# Altium schematic sheet VoltageSens.SchDoc
size A4
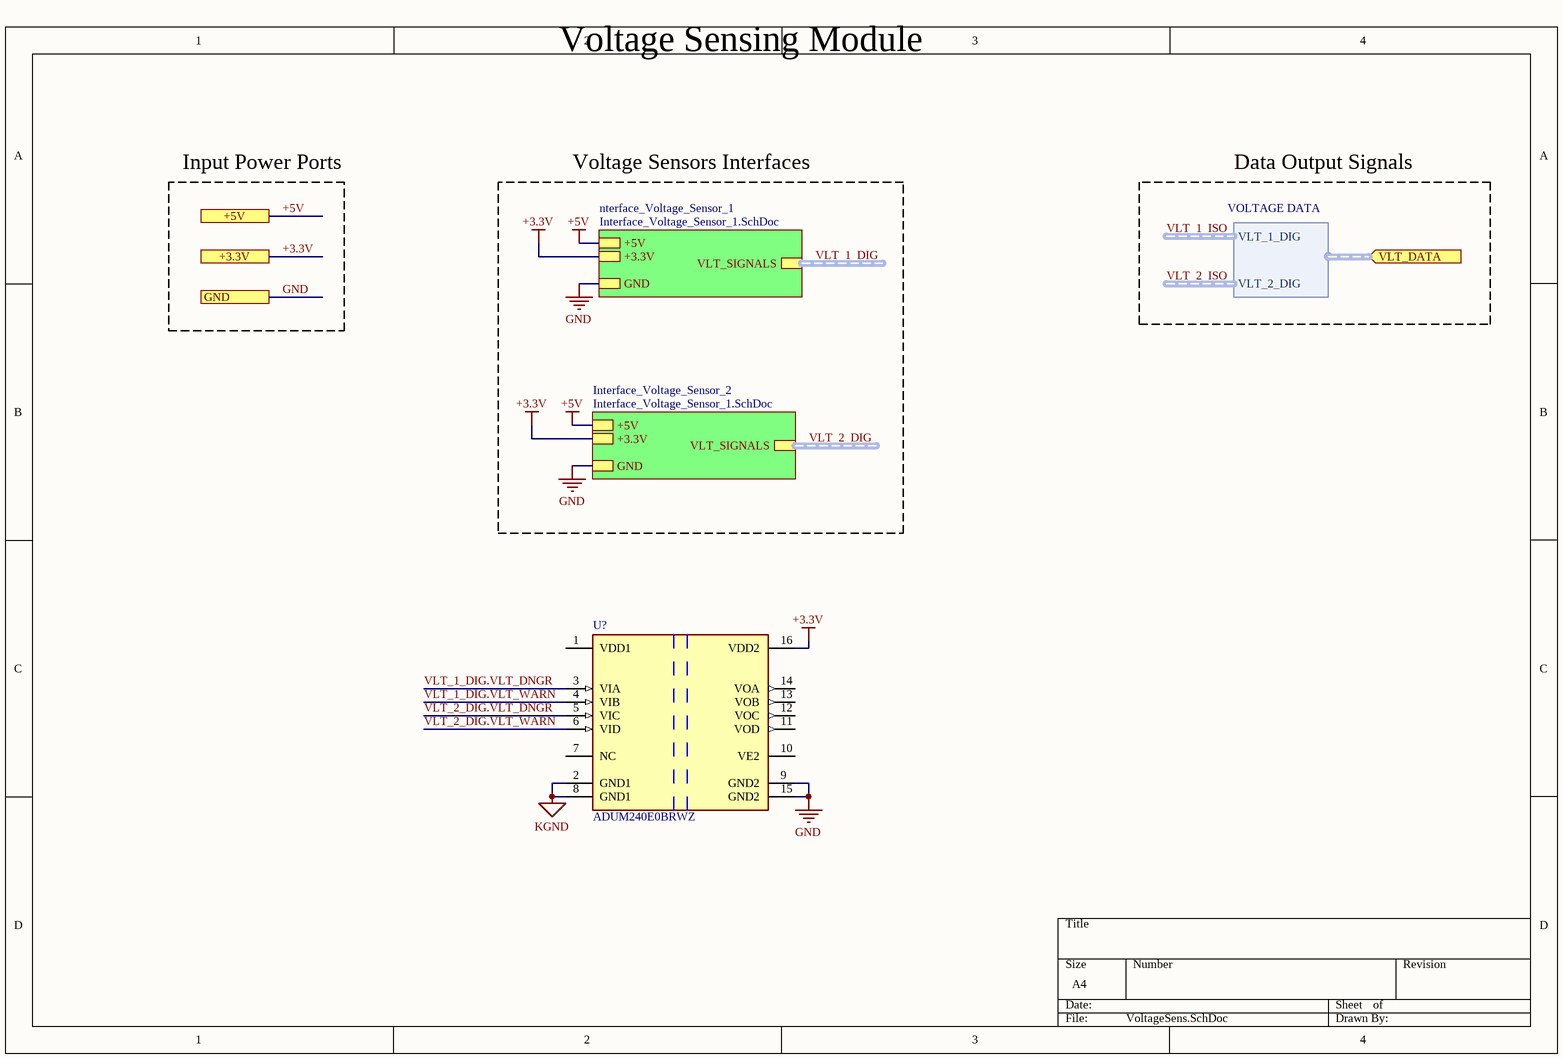
[diagram p0: VoltageSens.SchDoc]

## Parts
U?  ADUM240E0BRWZ  [FP-RW-16-IPC_A]

## Sub-sheets
Interface_Voltage_Sensor_2 = Interface_Voltage_Sensor_1.SchDoc: GND, +5V, +3.3V, VLT_SIGNALS (harness VOLTAGE SIGNALS)
nterface_Voltage_Sensor_1 = Interface_Voltage_Sensor_1.SchDoc: GND, +5V, +3.3V, VLT_SIGNALS (harness VOLTAGE SIGNALS)

## Ports
+3.3V, +5V, GND, VLT_DATA (in, harness VOLTAGE DATA)

## Harnesses
VOLTAGE DATA: VLT_1_DIG, VLT_2_DIG

## Nets
+3.3V: U?.16(VDD2) ; port +3.3V, sheet Interface_Voltage_Sensor_2/+3.3V, sheet nterface_Voltage_Sensor_1/+3.3V
+5V: port +5V, sheet Interface_Voltage_Sensor_2/+5V, sheet nterface_Voltage_Sensor_1/+5V
GND: U?.9(GND2) U?.15(GND2) ; port GND, sheet Interface_Voltage_Sensor_2/GND, sheet nterface_Voltage_Sensor_1/GND
KGND: U?.2(GND1) U?.8(GND1)
VLT_1_DIG.VLT_DNGR: U?.3(VIA)
VLT_1_DIG.VLT_WARN: U?.4(VIB)
VLT_2_DIG.VLT_DNGR: U?.5(VIC)
VLT_2_DIG.VLT_WARN: U?.6(VID)

Not connected (* = marked no-connect by the designer): U? 1(VDD1) 7(NC) 10(VE2) 11(VOD) 12(VOC) 13(VOB) 14(VOA)

## Buses and harness runs
harness VLT_1_DIG = sheet nterface_Voltage_Sensor_1/VLT_SIGNALS
harness VLT_2_DIG = sheet Interface_Voltage_Sensor_2/VLT_SIGNALS

## Notes on the sheet
- Voltage Sensing Module
- Input Power Ports
- Voltage Sensors Interfaces
- Data Output Signals

## Library data of the parts
U? = CMP-015-00008-1: Analog Circuit, 1 Func, CMOS, PDSO16; Min Supply Voltage: 1.7V; Time @ Peak Reflow Temperature-Max (s): 30s; Max Supply Voltage: 5.5V; Channels: 1; Package Body Material: Plastic; Nominal Supply Voltage: 1.8V; Height - Seated (Max): 2.65mm; JESD-30 Code: R-PDSO-G16; Peak Reflow Temperature (Cel): 260°C; Package Shape: Rectangular; Throw Configuration: ANALOG CIRCUIT; Technology: CMOS; RoHS Compliant: Yes; Terminal Position: DUAL; Case/Package: SOP; Terminal Form: Gull Wing; Min Operating Temperature: -40°C; Terminal Pitch: 1.27mm; Length: 10.3mm; Width: 7.5mm; Pins: 16; Surface Mount: Yes; Temperature Grade: AUTOMOTIVE; Reach SVHC Compliant: Yes; Package Style: SMALL OUTLINEMeter; Max Operating Temperature: 125°C